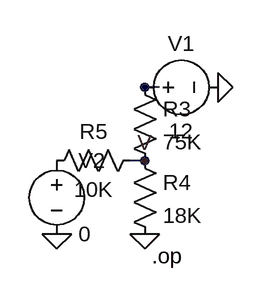
[diagram p0: schematic Draft2.asc]
Draft2.asc, the LTspice schematic file:
Version 4
SHEET 1 880 680
WIRE 192 112 176 112
WIRE 176 192 160 192
FLAG 176 272 0
FLAG 256 112 0
FLAG 176 192 V
FLAG 80 272 0
SYMBOL res 160 96 R0
SYMATTR InstName R3
SYMATTR Value 75K
SYMBOL res 160 176 R0
SYMATTR InstName R4
SYMATTR Value 18K
SYMBOL res 176 176 R90
WINDOW 0 0 56 VBottom 2
WINDOW 3 32 56 VTop 2
SYMATTR InstName R5
SYMATTR Value 10K
SYMBOL voltage 160 112 R270
WINDOW 0 32 56 VTop 2
WINDOW 3 -32 56 VBottom 2
WINDOW 123 0 0 Left 0
WINDOW 39 0 0 Left 0
SYMATTR InstName V1
SYMATTR Value 12
SYMBOL voltage 80 176 R0
WINDOW 123 0 0 Left 0
WINDOW 39 0 0 Left 0
SYMATTR InstName V2
SYMATTR Value 0
TEXT 184 296 Left 2 !.op

The netlist it stands for:
* Draft2.asc
R3 N001 V 75K
R4 V 0 18K
R5 V P001 10K
V1 N001 0 12
V2 P001 0 0
.op
.backanno
.end